# Altium project CTTM_CLAMP_PCB.PrjPcb
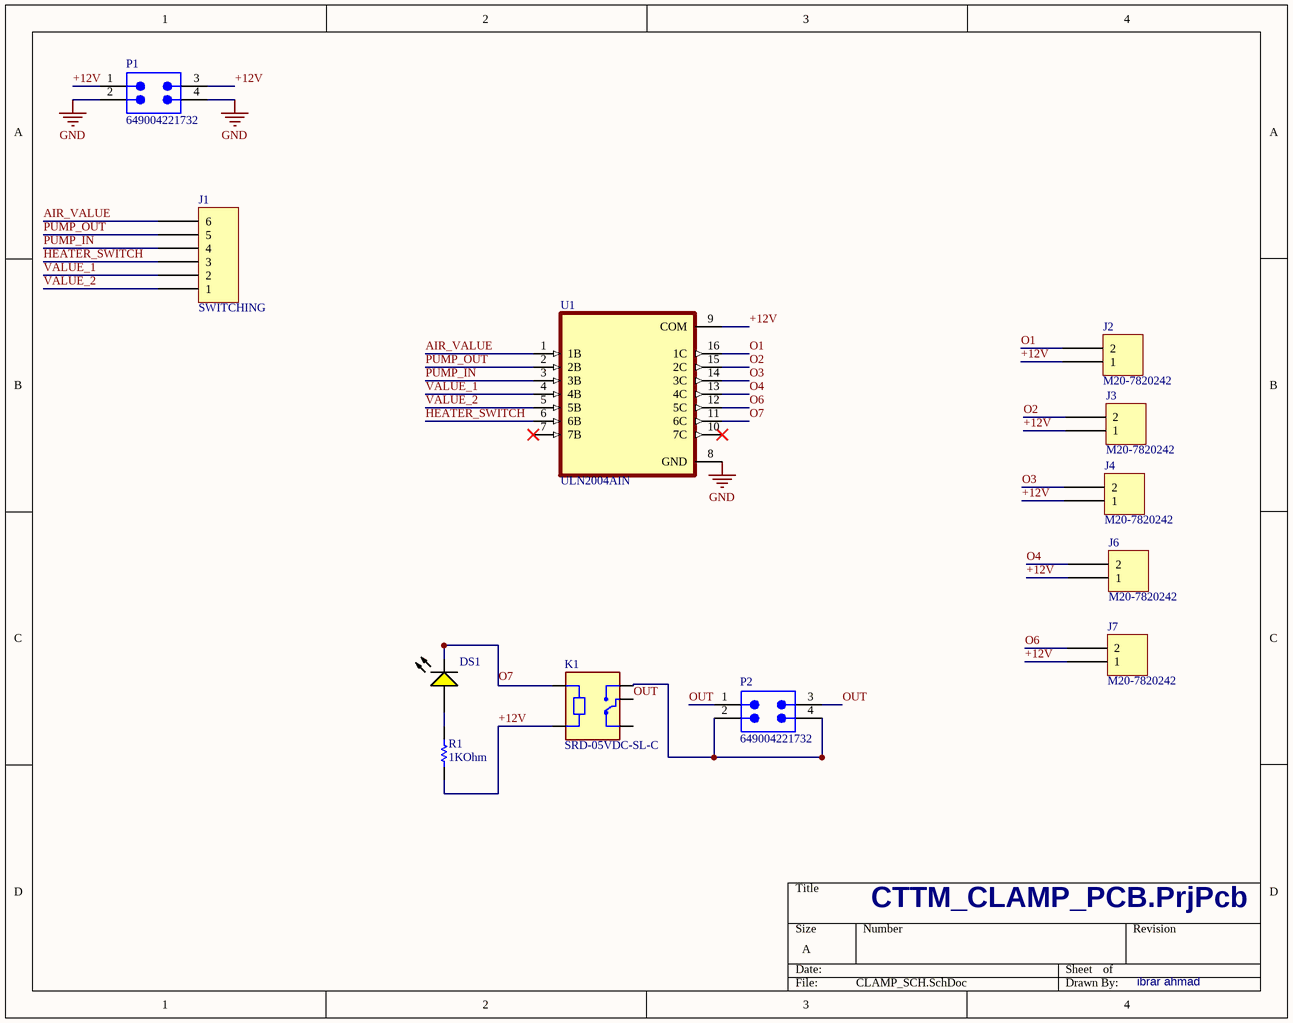
[diagram p0: CLAMP_SCH.SchDoc]
1 sheet, 12 parts. Net scope: global (net labels, ports and power ports of the same name join across sheets).
Board files: CLAMP_PCB.PcbDoc, PCB1.PcbDoc

## Sheet CLAMP_SCH.SchDoc
size A; Engineer: ibrar ahmad; SheetNumber: 1; SheetTotal: 1

### Parts
DS1  SML-LX1206YC-TR  [LUMX-SML-LX1206YC-TR_V]  (value not drawn)
J1  SWITCHING  [MOLEX KK 0022272061]
J2  M20-7820242  [HARWIN M20-7820245]
J3  M20-7820242  [HARWIN M20-7820245]
J4  M20-7820242  [HARWIN M20-7820245]
J6  M20-7820242  [HARWIN M20-7820245]
J7  M20-7820242  [HARWIN M20-7820245]
K1  SRD-05VDC-SL-C  [RELAY_SRD-05VDC-SL-C]
P1  649004221732  [649004221732]
P2  649004221732  [649004221732]
R1  Resistance: 1KOhm  [RESC3216X60X45ML15T20]  (hidden comment: CRCW12061K00FKEA)
U1  ULN2004AIN  [DIP794W45P254L1969H508Q16]

### Nets
GND: P1.2 P1.4 U1.8(GND)
+12V: J2.1 J3.1 J4.1 J6.1 J7.1 K1.A2 P1.1 P1.3 R1.1 U1.9(COM)
AIR_VALUE: J1.6 U1.1(1B)
HEATER_SWITCH: J1.3 U1.6(6B)
O1: J2.2 U1.16(1C)
O2: J3.2 U1.15(2C)
O3: J4.2 U1.14(3C)
O4: J6.2 U1.13(4C)
O6: J7.2 U1.12(5C)
O7: DS1.2(K) K1.A1 U1.11(6C)
OUT: K1.COM P2.1 P2.3
PUMP_IN: J1.4 U1.3(3B)
PUMP_OUT: J1.5 U1.2(2B)
VALUE_1: J1.2 U1.4(4B)
VALUE_2: J1.1 U1.5(5B)
NetDS1_1: DS1.1(A) R1.2
NetK1_NO: K1.NO P2.2 P2.4

Not connected (* = marked no-connect by the designer): K1 NC; U1 7(7B)* 10(7C)*

### Library data of the parts
DS1 = CMP-2000-07124-1: Yellow LED, Water Clear Len, 585 nm, 2.1 V, -40 to 85 degC, 2-Pin SMD, RoHS, Tape and Reel; Manufacturer: Lumex; Product Training Modules: LEDsBenefitsofCustomLEDandLCDTechnology; Millicandela Rating: 6mcd; Catalog Drawings: SML-LX1206SeriesTopSML-LX1206SeriesSideSML-LX1206SeriesBottomSML-LX1206SeriesFootprint; Wavelength - Peak: 585nm; Other Names: 67-1358-2LU60357TRSMLLX1206YCTR; Lens Style/Size: RectanglewithFlatTop; Current - Test: 20mA; Lens Color: Colorless; Viewing Angle: 160°; Voltage - Forward (Vf) (Typ): 2.1V; Online Catalog: SML-LX1206RectanglewithFlatTop1206PackageLEDs; Mounting Type: SurfaceMount; Package Description: 2-Pin Surface Mount Device, Body 3.2 x 1.5 mm; Datasheet Version: Rev. K, 08/2012; Features: -; Color: Yellow; RoHS Information: RoHSCertofCompliance; Package Reference: SML-LX1206YC-TR; Supplier Device Package: 1206; Standard Package: 3,000; Series: -; Wavelength - Dominant: -; Package / Case: 1206(3216Metric); Mounting Technology: SurfaceMount; Height (Max): 1.10mm; Lens Transparency: Clear; Datasheet URL: http://www.lumex.com/content/files/ProductAttachment/SML-LX1206YC-TR.pdf; Family: LEDIndication-Discrete; Manufacturer URL: http://www.lumexinstruments.com/; Packaging: Tape&Reel(TR); Category: Optoelectronics; Size / Dimension: 3.20mmLx1.60mmW
J1 = 0022272061: CONN HEADER VERT 6POS 2.54MM; Manufacturer: Molex; Contact Length - Mating: 0.295" (7.49mm); Contact Length - Post: 0.140" (3.56mm); Material Flammability Rating: UL94 V-0; Number of Positions: 6; Number of Positions Loaded: All; Overall Contact Length: 0.560" (14.22mm); Pitch - Mating: 0.100" (2.54mm); Shrouding: Shrouded - 1 Wall; Style: Board to Cable/Wire; Part Number: 0022272061; ComponentLink1Description: Datasheet; ComponentLink1URL: https://www.molex.com/pdm_docs/sd/022272061_sd.pdf; ComponentLink2Description: DigiKey Link; ComponentLink2URL: http://digikey.com/product-detail/en/molex/0022272061/WM4115-ND/1130581; Connector Type: Header; Contact Finish - Mating: Tin; Contact Finish - Post: Tin; Contact Finish Thickness - Mating: 100.0µin (2.54µm); Contact Material: Brass; Contact Shape: Square; Contact Type: Male Pin; Fastening Type: Friction Lock; Insulation Color: Natural; Insulation Height: 0.461" (11.70mm); Insulation Material: Polyamide (PA), Nylon; LastUpdated: 1/12/2020 11:52:24 PM; Lifecycle Status: Active; Minimum Order: 1; Mounting Type: Through Hole; Number of Rows: 1; Packaging: Bulk; PartId: 80; Part Status: Active; Price: 0.49; Series: KK 6410; Supplier 1: DigiKey; Supplier Part Number 1: WM4115-ND; Termination: Solder
J2-J4 J6 J7 = M20-7820242: CONN RCPT 2POS 0.1 GOLD PCB; Manufacturer: Harwin Inc.; Connector Type: Receptacle; Contact Length - Post: 0.118" (3.00mm); Current Rating (Amps): 3A; Mated Stacking Heights: 11.04mm, 12.63mm; Material Flammability Rating: UL94 V-0; Number of Positions: 2; Number of Positions Loaded: All; Pitch - Mating: 0.100" (2.54mm); Style: Board to Board or Cable; Part Number: M20-7820242; ComponentLink1Description: Datasheet; ComponentLink1URL: https://cdn.harwin.com/pdfs/C001XX_M20_Series_Connectors.pdf; ComponentLink2Description: DigiKey Link; ComponentLink2URL: https://www.digikey.com/en/products/detail/harwin-inc/M20-7820242/3727744; Contact Finish - Mating: Gold; Contact Finish - Post: Tin; Contact Finish Thickness - Mating: Flash; Contact Type: Female Socket; Fastening Type: Push-Pull; Insulation Color: Black; Insulation Height: 0.335" (8.51mm); LastUpdated: 9/21/2022 6:53:47 PM; Lifecycle Status: Active; Minimum Order: 1; Mounting Type: Through Hole; Number of Rows: 1; Operating Temperature: -40°C ~ 105°C; Packaging: Tube; Part Status: Active; Price: 0.38; Series: M20; Supplier 1: DigiKey; Supplier Part Number 1: 952-1775-ND; Termination: Solder
K1 = SRD-05VDC-SL-C: 5V Trigger Relay Module For Arduino And Raspberry Pi 5V Trigger Relay Module For Arduino And Raspberry Pi; MF: Songle Relay; Check_prices: https://www.snapeda.com/parts/SRD-05VDC-SL-C/Songle+Relay/view-part/?ref=eda; Value: *; Availability: Not in stock; Price: None; Package: NON STANDARD-5 Songle Relay; MP: SRD-05VDC-SL-C; SnapEDA_Link: https://www.snapeda.com/parts/SRD-05VDC-SL-C/Songle+Relay/view-part/?ref=snap
P1 P2 = CMP-1502-00506-2: NexarPartId: 23024601; Current Rating: 8A; Contact Resistance: 10mΩ; Gender: Male; Number of Contacts: 4; Insulation Resistance: 1GΩ; Row Spacing: 4.191mm; Operating Supply Voltage: 600V; Connector Type: Male Pin, Plug; Pitch: 4.2mm; Number of Pins: 4; Width: 9.6mm; Lead Pitch: 4.2mm; REACH SVHC: Unknown; Orientation: Vertical; Length: 9.6mm; Max Operating Temperature: 105°C; Min Operating Temperature: -40°C; Color: White; Contact Material: Copper; Termination: Solder; RoHS: Compliant; Fastening Type: Ramp; Contact Plating: Tin; Number of Positions: 4; Mount: Through Hole; Number of Rows: 2; Height: 12.8mm
R1 = CMP-2100-03616-1: Chip Resistor, 1 KOhm, +/- 1%, 0.25 W, -55 to 155 degC, 1206 (3216 Metric), RoHS, Tape and Reel; Manufacturer: Vishay Semiconductor; Power Rating: 250mW; Voltage Rating (DC): 200V; Temperature Coefficient: 100ppm/degreesC; Case Code (Imperial): 1206; Length: 3.2mm; Case/Package: 1206; Contact Plating: Tin; Package Quantity: 10; Datasheet URL: http://www.farnell.com/datasheets/1720486.pdf; Mount: SurfaceMount; Package Description: 2-Pin Surface Mount Device, Body 3.15 x 1.6 mm; Package Reference: 1206.0; Max Operating Temperature: 155degC; Lead Free: LeadFree; Weight: 0.000353oz; Military Standard: Not; Max Power Dissipation: 250mW; Case Code (Metric): 3216; Number of Terminations: 2; Tolerance: 1%; Width: 0.063inch; Termination: SMD/SMT; Number of Pins: 2; Min Operating Temperature: -55degC; Height: 0.55mm; Depth: 1.6mm; RoHSCompliant: true; Composition: ThickFilm; Packaging: TapeandReel; Manufacturer URL: http://www.vishay.com/; Voltage Rating: 200V; Radiation Hardening: No; REACH SVHC: Unknown; Datasheet Version: 41061.0
U1 = ULN2004AIN: 50-V, 7-ch darlington transistor array with 15-V input capability, -40 to 105C 16-PDIP -40 to 105; MF: Texas Instruments; Price: None; Value: *; DigiKey-Purchase-URL: https://snapeda.com/shop?store=DigiKey&id=826398; MP: ULN2004AIN; Package: PDIP-16 Texas Instruments; SnapEDA_Link: https://www.snapeda.com/parts/ULN2004AIN/Texas%20Instruments/view-part/826398/?ref=snap; Mouser-Purchase-URL: https://snapeda.com/shop?store=Mouser&id=826398; Availability: Warning; Texas_Instruments-Purchase-URL: https://snapeda.com/shop?store=Texas+Instruments&id=826398; Check_prices: https://www.snapeda.com/parts/ULN2004AIN/Texas%20Instruments/view-part/826398/?ref=eda